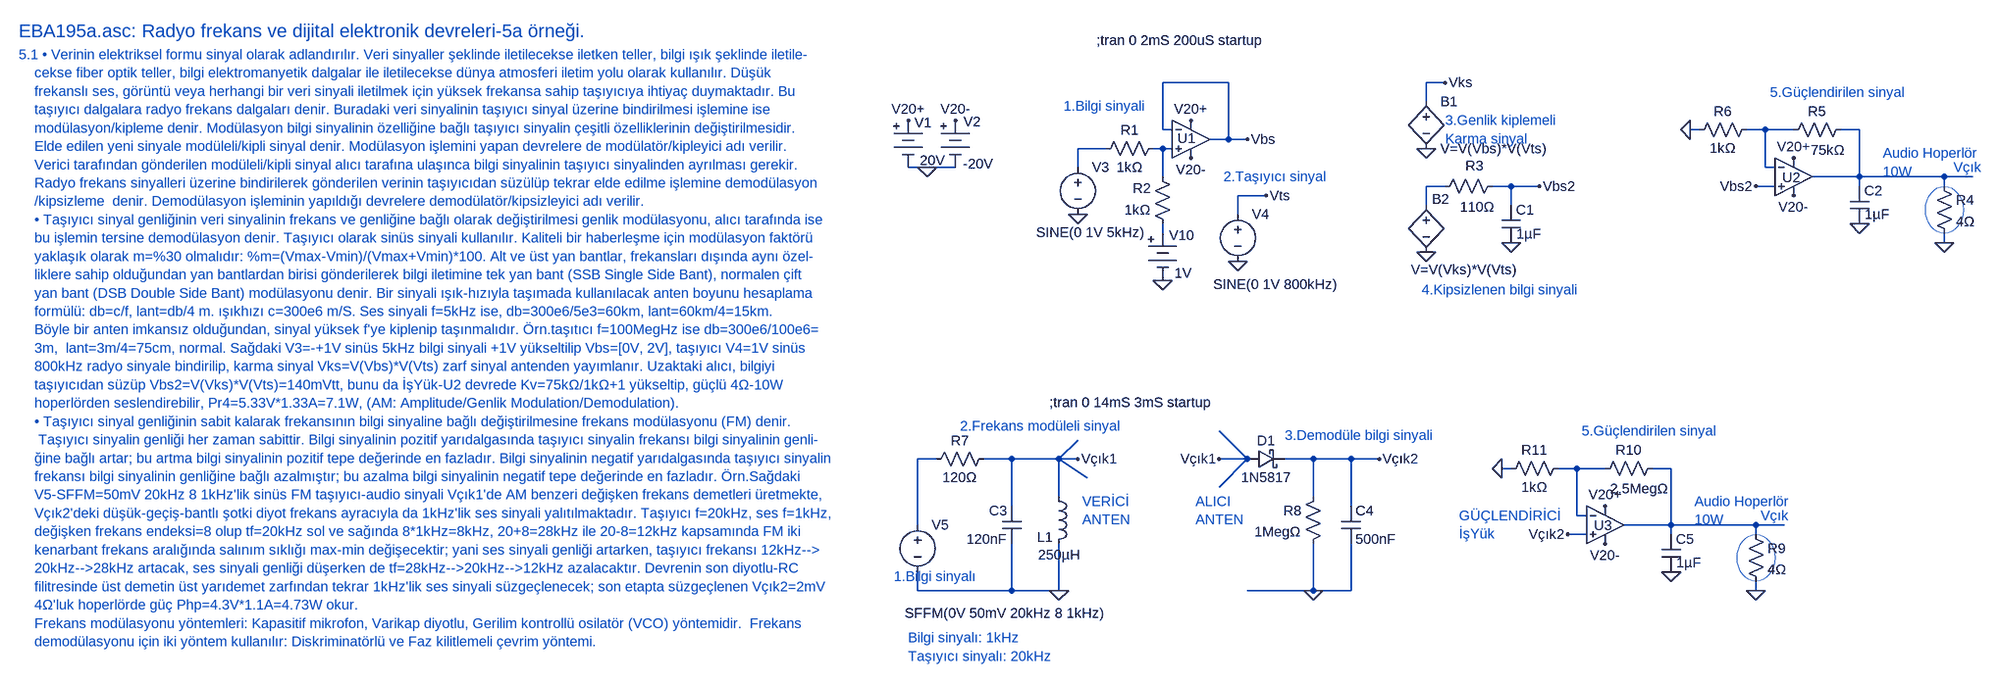
[diagram p0: schematic EBA195a.asc]
EBA195a.asc, the LTspice schematic file:
Version 4
SHEET 1 7064 4332
WIRE 2448 144 2336 144
WIRE 2816 144 2784 144
WIRE 2784 176 2784 144
WIRE 2336 224 2336 144
WIRE 2352 224 2336 224
WIRE 3248 224 3232 224
WIRE 3360 224 3328 224
WIRE 3408 224 3360 224
WIRE 3520 224 3488 224
WIRE 2448 240 2448 144
WIRE 2448 240 2416 240
WIRE 2480 240 2448 240
WIRE 2240 256 2192 256
WIRE 2336 256 2320 256
WIRE 2352 256 2336 256
WIRE 1936 288 1904 288
WIRE 1984 288 1936 288
WIRE 2192 288 2192 256
WIRE 3360 288 3360 224
WIRE 3376 288 3360 288
WIRE 2336 304 2336 256
WIRE 3520 304 3520 224
WIRE 3520 304 3440 304
WIRE 3664 304 3520 304
WIRE 3712 304 3664 304
WIRE 2816 320 2784 320
WIRE 2928 320 2896 320
WIRE 2976 320 2928 320
WIRE 3376 320 3344 320
WIRE 3520 320 3520 304
WIRE 3664 320 3664 304
WIRE 2512 336 2464 336
WIRE 2784 352 2784 320
WIRE 2928 352 2928 320
WIRE 2464 368 2464 336
WIRE 2336 400 2336 384
WIRE 3664 416 3664 400
WIRE 1952 784 1920 784
WIRE 2080 784 2032 784
WIRE 2160 784 2192 752
WIRE 2160 784 2080 784
WIRE 2192 784 2160 784
WIRE 2480 784 2432 736
WIRE 2480 784 2432 784
WIRE 2592 784 2544 784
WIRE 2656 784 2592 784
WIRE 2704 784 2656 784
WIRE 2928 800 2912 800
WIRE 3040 800 3008 800
WIRE 3088 800 3040 800
WIRE 3200 800 3168 800
WIRE 2208 816 2160 784
WIRE 2432 832 2480 784
WIRE 2160 848 2160 784
WIRE 2592 848 2592 784
WIRE 2080 864 2080 784
WIRE 2656 864 2656 784
WIRE 3040 880 3040 800
WIRE 3056 880 3040 880
WIRE 1920 896 1920 784
WIRE 3200 896 3200 800
WIRE 3200 896 3120 896
WIRE 3344 896 3200 896
WIRE 3392 896 3344 896
WIRE 3056 912 3024 912
WIRE 3200 912 3200 896
WIRE 3344 912 3344 896
WIRE 1920 1008 1920 976
WIRE 2080 1008 2080 928
WIRE 2080 1008 1920 1008
WIRE 2160 1008 2160 928
WIRE 2160 1008 2080 1008
WIRE 2592 1008 2592 928
WIRE 2592 1008 2480 1008
WIRE 2656 1008 2656 928
WIRE 2656 1008 2592 1008
WIRE 3344 1008 3344 992
FLAG 1936 288 0
FLAG 1904 208 V20+
FLAG 1984 208 V20-
FLAG 2384 208 V20+
FLAG 2384 272 V20-
FLAG 2192 368 0
FLAG 2336 480 0
FLAG 2464 448 0
FLAG 2784 256 0
FLAG 2480 240 Vbs
FLAG 2512 336 Vts
FLAG 2816 144 Vks
FLAG 2784 432 0
FLAG 2928 416 0
FLAG 2976 320 Vbs2
FLAG 3520 384 0
FLAG 3664 416 0
FLAG 3408 272 V20+
FLAG 3408 336 V20-
FLAG 3232 224 0
FLAG 3344 320 Vbs2
FLAG 2160 1008 0
FLAG 2192 784 Vçık1
FLAG 2592 1008 0
FLAG 2432 784 Vçık1
FLAG 3200 976 0
FLAG 3344 1008 0
FLAG 3088 864 V20+
FLAG 3088 928 V20-
FLAG 2912 800 0
FLAG 2704 784 Vçık2
FLAG 3024 912 Vçık2
SYMBOL Misc\\battery 1904 192 R0
WINDOW 0 11 20 Left 2
WINDOW 3 20 84 Left 2
SYMATTR InstName V1
SYMATTR Value 20V
SYMBOL Misc\\battery 1984 192 R0
WINDOW 0 14 18 Left 2
WINDOW 3 13 90 Left 2
SYMATTR InstName V2
SYMATTR Value -20V
SYMBOL Opamps\\UniversalOpamp2 2384 240 R0
WINDOW 0 -23 -1 Left 2
SYMATTR InstName U1
SYMBOL res 2336 240 R90
WINDOW 0 0 56 VBottom 2
WINDOW 3 32 56 VTop 2
SYMATTR InstName R1
SYMATTR Value 1kΩ
SYMBOL res 2352 400 R180
WINDOW 0 36 76 Left 2
WINDOW 3 36 40 Left 2
SYMATTR InstName R2
SYMATTR Value 1kΩ
SYMBOL voltage 2192 272 R0
WINDOW 3 -71 127 Left 2
WINDOW 123 0 0 Left 0
WINDOW 39 0 0 Left 0
SYMATTR Value SINE(0 1V 5kHz)
SYMATTR InstName V3
SYMBOL voltage 2464 352 R0
WINDOW 3 -42 135 Left 2
WINDOW 123 0 0 Left 0
WINDOW 39 0 0 Left 0
SYMATTR Value SINE(0 1V 800kHz)
SYMATTR InstName V4
SYMBOL bv 2784 160 R0
SYMATTR InstName B1
SYMATTR Value V=V(Vbs)*V(Vts)
SYMBOL bv 2784 336 R0
WINDOW 0 10 6 Left 2
WINDOW 3 -26 126 Left 2
SYMATTR InstName B2
SYMATTR Value V=V(Vks)*V(Vts)
SYMBOL res 2912 304 R90
WINDOW 0 -3 46 VBottom 2
WINDOW 3 36 41 VTop 2
SYMATTR InstName R3
SYMATTR Value 110Ω
SYMBOL cap 2912 352 R0
WINDOW 3 25 49 Left 2
SYMATTR Value 1µF
SYMATTR InstName C1
SYMBOL cap 3504 320 R0
WINDOW 3 25 48 Left 2
SYMATTR Value 1µF
SYMATTR InstName C2
SYMBOL res 3648 304 R0
SYMATTR InstName R4
SYMATTR Value 4Ω
SYMBOL res 3504 208 R90
WINDOW 0 0 56 VBottom 2
WINDOW 3 35 38 VTop 2
SYMATTR InstName R5
SYMATTR Value 75kΩ
SYMBOL res 3344 208 R90
WINDOW 0 0 56 VBottom 2
WINDOW 3 32 56 VTop 2
SYMATTR InstName R6
SYMATTR Value 1kΩ
SYMBOL OpAmps\\UniversalOpAmp 3408 304 R0
WINDOW 0 -19 1 Left 2
SYMATTR InstName U2
SYMBOL Misc\\battery 2336 384 R0
WINDOW 0 11 20 Left 2
WINDOW 3 20 84 Left 2
SYMATTR InstName V10
SYMATTR Value 1V
SYMBOL voltage 1920 880 R0
WINDOW 3 -22 166 Left 2
WINDOW 123 0 0 Left 0
WINDOW 39 0 0 Left 0
SYMATTR Value SFFM(0V 50mV 20kHz 8 1kHz)
SYMATTR InstName V5
SYMBOL res 2048 768 R90
WINDOW 0 0 56 VBottom 2
WINDOW 3 32 56 VTop 2
SYMATTR InstName R7
SYMATTR Value 120Ω
SYMBOL cap 2096 864 M0
SYMATTR InstName C3
SYMATTR Value 120nF
SYMBOL ind 2144 832 R0
WINDOW 0 -21 85 Left 2
WINDOW 3 -19 115 Left 2
SYMATTR InstName L1
SYMATTR Value 250µH
SYMBOL res 2608 832 M0
SYMATTR InstName R8
SYMATTR Value 1MegΩ
SYMBOL cap 2640 864 R0
SYMATTR InstName C4
SYMATTR Value 500nF
SYMBOL schottky 2480 768 M90
WINDOW 0 0 32 VBottom 2
WINDOW 3 32 32 VTop 2
SYMATTR InstName D1
SYMATTR Value 1N5817
SYMATTR Description Diode
SYMATTR Type varactor
SYMBOL cap 3184 912 R0
WINDOW 3 25 48 Left 2
SYMATTR Value 1µF
SYMATTR InstName C5
SYMBOL res 3328 896 R0
SYMATTR InstName R9
SYMATTR Value 4Ω
SYMBOL res 3184 784 R90
WINDOW 0 0 56 VBottom 2
WINDOW 3 35 38 VTop 2
SYMATTR InstName R10
SYMATTR Value 2.5MegΩ
SYMBOL res 3024 784 R90
WINDOW 0 0 56 VBottom 2
WINDOW 3 32 56 VTop 2
SYMATTR InstName R11
SYMATTR Value 1kΩ
SYMBOL OpAmps\\UniversalOpAmp 3088 896 R0
WINDOW 0 -19 1 Left 2
SYMATTR InstName U3
TEXT -232 56 Left 3 ;EBA195a.asc: Radyo frekans ve dijital elektronik devreleri-5a örneği.
TEXT -232 96 Left 2 ;5.1 • Verinin elektriksel formu sinyal olarak adlandırılır. Veri sinyaller şeklinde iletilecekse iletken teller, bilgi ışık şeklinde iletile-\n    cekse fiber optik teller, bilgi elektromanyetik dalgalar ile iletilecekse dünya atmosferi iletim yolu olarak kullanılır. Düşük \n    frekanslı ses, görüntü veya herhangi bir veri sinyali iletilmek için yüksek frekansa sahip taşıyıcıya ihtiyaç duymaktadır. Bu \n    taşıyıcı dalgalara radyo frekans dalgaları denir. Buradaki veri sinyalinin taşıyıcı sinyal üzerine bindirilmesi işlemine ise \n    modülasyon/kipleme denir. Modülasyon bilgi sinyalinin özelliğine bağlı taşıyıcı sinyalin çeşitli özelliklerinin değiştirilmesidir. \n    Elde edilen yeni sinyale modüleli/kipli sinyal denir. Modülasyon işlemini yapan devrelere de modülatör/kipleyici adı verilir.\n    Verici tarafından gönderilen modüleli/kipli sinyal alıcı tarafına ulaşınca bilgi sinyalinin taşıyıcı sinyalinden ayrılması gerekir. \n    Radyo frekans sinyalleri üzerine bindirilerek gönderilen verinin taşıyıcıdan süzülüp tekrar elde edilme işlemine demodülasyon\n    /kipsizleme  denir. Demodülasyon işleminin yapıldığı devrelere demodülatör/kipsizleyici adı verilir.\n    • Taşıyıcı sinyal genliğinin veri sinyalinin frekans ve genliğine bağlı olarak değiştirilmesi genlik modülasyonu, alıcı tarafında ise\n    bu işlemin tersine demodülasyon denir. Taşıyıcı olarak sinüs sinyali kullanılır. Kaliteli bir haberleşme için modülasyon faktörü \n    yaklaşık olarak m=%30 olmalıdır: %m=(Vmax-Vmin)/(Vmax+Vmin)*100. Alt ve üst yan bantlar, frekansları dışında aynı özel-\n    liklere sahip olduğundan yan bantlardan birisi gönderilerek bilgi iletimine tek yan bant (SSB Single Side Bant), normalen çift \n    yan bant (DSB Double Side Bant) modülasyonu denir. Bir sinyali ışık-hızıyla taşımada kullanılacak anten boyunu hesaplama\n    formülü: db=c/f, lant=db/4 m. ışıkhızı c=300e6 m/S. Ses sinyali f=5kHz ise, db=300e6/5e3=60km, lant=60km/4=15km. \n    Böyle bir anten imkansız olduğundan, sinyal yüksek f'ye kiplenip taşınmalıdır. Örn.taşıtıcı f=100MegHz ise db=300e6/100e6=\n    3m,  lant=3m/4=75cm, normal. Sağdaki V3=-+1V sinüs 5kHz bilgi sinyali +1V yükseltilip Vbs=[0V, 2V], taşıyıcı V4=1V sinüs \n    800kHz radyo sinyale bindirilip, karma sinyal Vks=V(Vbs)*V(Vts) zarf sinyal antenden yayımlanır. Uzaktaki alıcı, bilgiyi \n    taşıyıcıdan süzüp Vbs2=V(Vks)*V(Vts)=140mVtt, bunu da İşYük-U2 devrede Kv=75kΩ/1kΩ+1 yükseltip, güçlü 4Ω-10W\n    hoperlörden seslendirebilir, Pr4=5.33V*1.33A=7.1W, (AM: Amplitude/Genlik Modulation/Demodulation).\n    • Taşıyıcı sinyal genliğinin sabit kalarak frekansının bilgi sinyaline bağlı değiştirilmesine frekans modülasyonu (FM) denir.\n     Taşıyıcı sinyalin genliği her zaman sabittir. Bilgi sinyalinin pozitif yarıdalgasında taşıyıcı sinyalin frekansı bilgi sinyalinin genli-\n    ğine bağlı artar; bu artma bilgi sinyalinin pozitif tepe değerinde en fazladır. Bilgi sinyalinin negatif yarıdalgasında taşıyıcı sinyalin \n    frekansı bilgi sinyalinin genliğine bağlı azalmıştır; bu azalma bilgi sinyalinin negatif tepe değerinde en fazladır. Örn.Sağdaki \n    V5-SFFM=50mV 20kHz 8 1kHz'lik sinüs FM taşıyıcı-audio sinyali Vçık1'de AM benzeri değişken frekans demetleri üretmekte, \n    Vçık2'deki düşük-geçiş-bantlı şotki diyot frekans ayracıyla da 1kHz'lik ses sinyali yalıtılmaktadır. Taşıyıcı f=20kHz, ses f=1kHz,\n    değişken frekans endeksi=8 olup tf=20kHz sol ve sağında 8*1kHz=8kHz, 20+8=28kHz ile 20-8=12kHz kapsamında FM iki\n    kenarbant frekans aralığında salınım sıklığı max-min değişecektir; yani ses sinyali genliği artarken, taşıyıcı frekansı 12kHz-->\n    20kHz-->28kHz artacak, ses sinyali genliği düşerken de tf=28kHz-->20kHz-->12kHz azalacaktır. Devrenin son diyotlu-RC \n    filitresinde üst demetin üst yarıdemet zarfından tekrar 1kHz'lik ses sinyali süzgeçlenecek; son etapta süzgeçlenen Vçık2=2mV\n    4Ω'luk hoperlörde güç Php=4.3V*1.1A=4.73W okur.\n    Frekans modülasyonu yöntemleri: Kapasitif mikrofon, Varikap diyotlu, Gerilim kontrollü osilatör (VCO) yöntemidir.  Frekans \n    demodülasyonu için iki yöntem kullanılır: Diskriminatörlü ve Faz kilitlemeli çevrim yöntemi.
TEXT 2224 72 Left 2 !;tran 0 2mS 200uS startup
TEXT 3560 264 Left 2 ;Audio Hoperlör\n10W
TEXT 2168 184 Left 2 ;1.Bilgi sinyali
TEXT 2440 304 Left 2 ;2.Taşıyıcı sinyal
TEXT 2816 208 Left 2 ;3.Genlik kiplemeli\nKarma sinyal
TEXT 2776 496 Left 2 ;4.Kipsizlenen bilgi sinyali
TEXT 3368 160 Left 2 ;5.Güçlendirilen sinyal
TEXT 3680 288 Left 2 ;Vçık
TEXT 2144 688 Left 2 !;tran 0 14mS 3mS startup
TEXT 1880 984 Left 2 ;1.Bilgi sinyalı
TEXT 1992 728 Left 2 ;2.Frekans modüleli sinyal
TEXT 1904 1088 Left 2 ;Bilgi sinyalı: 1kHz\nTaşıyıcı sinyalı: 20kHz
TEXT 2544 744 Left 2 ;3.Demodüle bilgi sinyali
TEXT 3240 856 Left 2 ;Audio Hoperlör\n10W
TEXT 3048 736 Left 2 ;5.Güçlendirilen sinyal
TEXT 2200 856 Left 2 ;VERİCİ\nANTEN
TEXT 2392 856 Left 2 ;ALICI\nANTEN
TEXT 2840 880 Left 2 ;GÜÇLENDİRİCİ\nİşYük
TEXT 3352 880 Left 2 ;Vçık
CIRCLE Normal 3696 400 3632 320 2
CIRCLE Normal 3376 992 3312 912 2

The netlist it stands for:
* EBA195a.asc
V1 V20+ 0 20V
V2 V20- 0 -20V
XU1 N004 Vbs V20+ V20- Vbs level.2 Avol=1Meg GBW=10Meg Slew=10Meg ilimit=25m rail=0 Vos=0 phimargin=45 en=0 enk=0 in=0 ink=0 Rin=500Meg  ; pins IN+ IN- V+ V- OUT
R1 N004 N003 1kΩ
R2 N006 N004 1kΩ
V3 N003 0 SINE(0 1V 5kHz)
V4 Vts 0 SINE(0 1V 800kHz)
B1 Vks 0 V=V(Vbs)*V(Vts)
B2 N005 0 V=V(Vks)*V(Vts)
R3 Vbs2 N005 110Ω
C1 Vbs2 0 1µF
C2 N002 0 1µF
R4 N002 0 4Ω
R5 N002 N001 75kΩ
R6 N001 0 1kΩ
XU2 Vbs2 N001 V20+ V20- N002 level1 Avol=1Meg GBW=10Meg Vos=0 En=0 Enk=0 In=0 Ink=0 Rin=500Meg  ; pins In+ In- V+ V- OUT
V10 N006 0 1V
V5 N007 0 SFFM(0V 50mV 20kHz 8 1kHz)
R7 Vçık1 N007 120Ω
C3 Vçık1 0 120nF
L1 Vçık1 0 250µH
R8 Vçık2 0 1MegΩ
C4 Vçık2 0 500nF
D1 Vçık1 Vçık2 1N5817
C5 N009 0 1µF
R9 N009 0 4Ω
R10 N009 N008 2.5MegΩ
R11 N008 0 1kΩ
XU3 Vçık2 N008 V20+ V20- N009 level1 Avol=1Meg GBW=10Meg Vos=0 En=0 Enk=0 In=0 Ink=0 Rin=500Meg  ; pins In+ In- V+ V- OUT
.model D D
.lib standard.dio
* EBA195a.asc: Radyo frekans ve dijital elektronik devreleri-5a örneği.
* 5.1 • Verinin elektriksel formu sinyal olarak adlandırılır. Veri sinyaller şeklinde iletilecekse iletken teller, bilgi ışık şeklinde iletile-
*     cekse fiber optik teller, bilgi elektromanyetik dalgalar ile iletilecekse dünya atmosferi iletim yolu olarak kullanılır. Düşük
*     frekanslı ses, görüntü veya herhangi bir veri sinyali iletilmek için yüksek frekansa sahip taşıyıcıya ihtiyaç duymaktadır. Bu
*     taşıyıcı dalgalara radyo frekans dalgaları denir. Buradaki veri sinyalinin taşıyıcı sinyal üzerine bindirilmesi işlemine ise
*     modülasyon/kipleme denir. Modülasyon bilgi sinyalinin özelliğine bağlı taşıyıcı sinyalin çeşitli özelliklerinin değiştirilmesidir.
*     Elde edilen yeni sinyale modüleli/kipli sinyal denir. Modülasyon işlemini yapan devrelere de modülatör/kipleyici adı verilir.
*     Verici tarafından gönderilen modüleli/kipli sinyal alıcı tarafına ulaşınca bilgi sinyalinin taşıyıcı sinyalinden ayrılması gerekir.
*     Radyo frekans sinyalleri üzerine bindirilerek gönderilen verinin taşıyıcıdan süzülüp tekrar elde edilme işlemine demodülasyon
*     /kipsizleme  denir. Demodülasyon işleminin yapıldığı devrelere demodülatör/kipsizleyici adı verilir.
*     • Taşıyıcı sinyal genliğinin veri sinyalinin frekans ve genliğine bağlı olarak değiştirilmesi genlik modülasyonu, alıcı tarafında ise
*     bu işlemin tersine demodülasyon denir. Taşıyıcı olarak sinüs sinyali kullanılır. Kaliteli bir haberleşme için modülasyon faktörü
*     yaklaşık olarak m=%30 olmalıdır: %m=(Vmax-Vmin)/(Vmax+Vmin)*100. Alt ve üst yan bantlar, frekansları dışında aynı özel-
*     liklere sahip olduğundan yan bantlardan birisi gönderilerek bilgi iletimine tek yan bant (SSB Single Side Bant), normalen çift
*     yan bant (DSB Double Side Bant) modülasyonu denir. Bir sinyali ışık-hızıyla taşımada kullanılacak anten boyunu hesaplama
*     formülü: db=c/f, lant=db/4 m. ışıkhızı c=300e6 m/S. Ses sinyali f=5kHz ise, db=300e6/5e3=60km, lant=60km/4=15km.
*     Böyle bir anten imkansız olduğundan, sinyal yüksek f'ye kiplenip taşınmalıdır. Örn.taşıtıcı f=100MegHz ise db=300e6/100e6=
*     3m,  lant=3m/4=75cm, normal. Sağdaki V3=-+1V sinüs 5kHz bilgi sinyali +1V yükseltilip Vbs=[0V, 2V], taşıyıcı V4=1V sinüs
*     800kHz radyo sinyale bindirilip, karma sinyal Vks=V(Vbs)*V(Vts) zarf sinyal antenden yayımlanır. Uzaktaki alıcı, bilgiyi
*     taşıyıcıdan süzüp Vbs2=V(Vks)*V(Vts)=140mVtt, bunu da İşYük-U2 devrede Kv=75kΩ/1kΩ+1 yükseltip, güçlü 4Ω-10W
*     hoperlörden seslendirebilir, Pr4=5.33V*1.33A=7.1W, (AM: Amplitude/Genlik Modulation/Demodulation).
*     • Taşıyıcı sinyal genliğinin sabit kalarak frekansının bilgi sinyaline bağlı değiştirilmesine frekans modülasyonu (FM) denir.
*      Taşıyıcı sinyalin genliği her zaman sabittir. Bilgi sinyalinin pozitif yarıdalgasında taşıyıcı sinyalin frekansı bilgi sinyalinin genli-
*     ğine bağlı artar; bu artma bilgi sinyalinin pozitif tepe değerinde en fazladır. Bilgi sinyalinin negatif yarıdalgasında taşıyıcı sinyalin
*     frekansı bilgi sinyalinin genliğine bağlı azalmıştır; bu azalma bilgi sinyalinin negatif tepe değerinde en fazladır. Örn.Sağdaki
*     V5-SFFM=50mV 20kHz 8 1kHz'lik sinüs FM taşıyıcı-audio sinyali Vçık1'de AM benzeri değişken frekans demetleri üretmekte,
*     Vçık2'deki düşük-geçiş-bantlı şotki diyot frekans ayracıyla da 1kHz'lik ses sinyali yalıtılmaktadır. Taşıyıcı f=20kHz, ses f=1kHz,
*     değişken frekans endeksi=8 olup tf=20kHz sol ve sağında 8*1kHz=8kHz, 20+8=28kHz ile 20-8=12kHz kapsamında FM iki
*     kenarbant frekans aralığında salınım sıklığı max-min değişecektir; yani ses sinyali genliği artarken, taşıyıcı frekansı 12kHz-->
*     20kHz-->28kHz artacak, ses sinyali genliği düşerken de tf=28kHz-->20kHz-->12kHz azalacaktır. Devrenin son diyotlu-RC
*     filitresinde üst demetin üst yarıdemet zarfından tekrar 1kHz'lik ses sinyali süzgeçlenecek; son etapta süzgeçlenen Vçık2=2mV
*     4Ω'luk hoperlörde güç Php=4.3V*1.1A=4.73W okur.
*     Frekans modülasyonu yöntemleri: Kapasitif mikrofon, Varikap diyotlu, Gerilim kontrollü osilatör (VCO) yöntemidir.  Frekans
*     demodülasyonu için iki yöntem kullanılır: Diskriminatörlü ve Faz kilitlemeli çevrim yöntemi.
;tran 0 2mS 200uS startup
* Audio Hoperlör
* 10W
* 1.Bilgi sinyali
* 2.Taşıyıcı sinyal
* 3.Genlik kiplemeli
* Karma sinyal
* 4.Kipsizlenen bilgi sinyali
* 5.Güçlendirilen sinyal
* Vçık
;tran 0 14mS 3mS startup
* 1.Bilgi sinyalı
* 2.Frekans modüleli sinyal
* Bilgi sinyalı: 1kHz
* Taşıyıcı sinyalı: 20kHz
* 3.Demodüle bilgi sinyali
* Audio Hoperlör
* 10W
* 5.Güçlendirilen sinyal
* VERİCİ
* ANTEN
* ALICI
* ANTEN
* GÜÇLENDİRİCİ
* İşYük
* Vçık
.lib UniversalOpamps2.sub
.lib UniversalOpAmp1.lib
.backanno
.end